# EAGLE design LightSwitch2 (EAGLE 9.0.0)
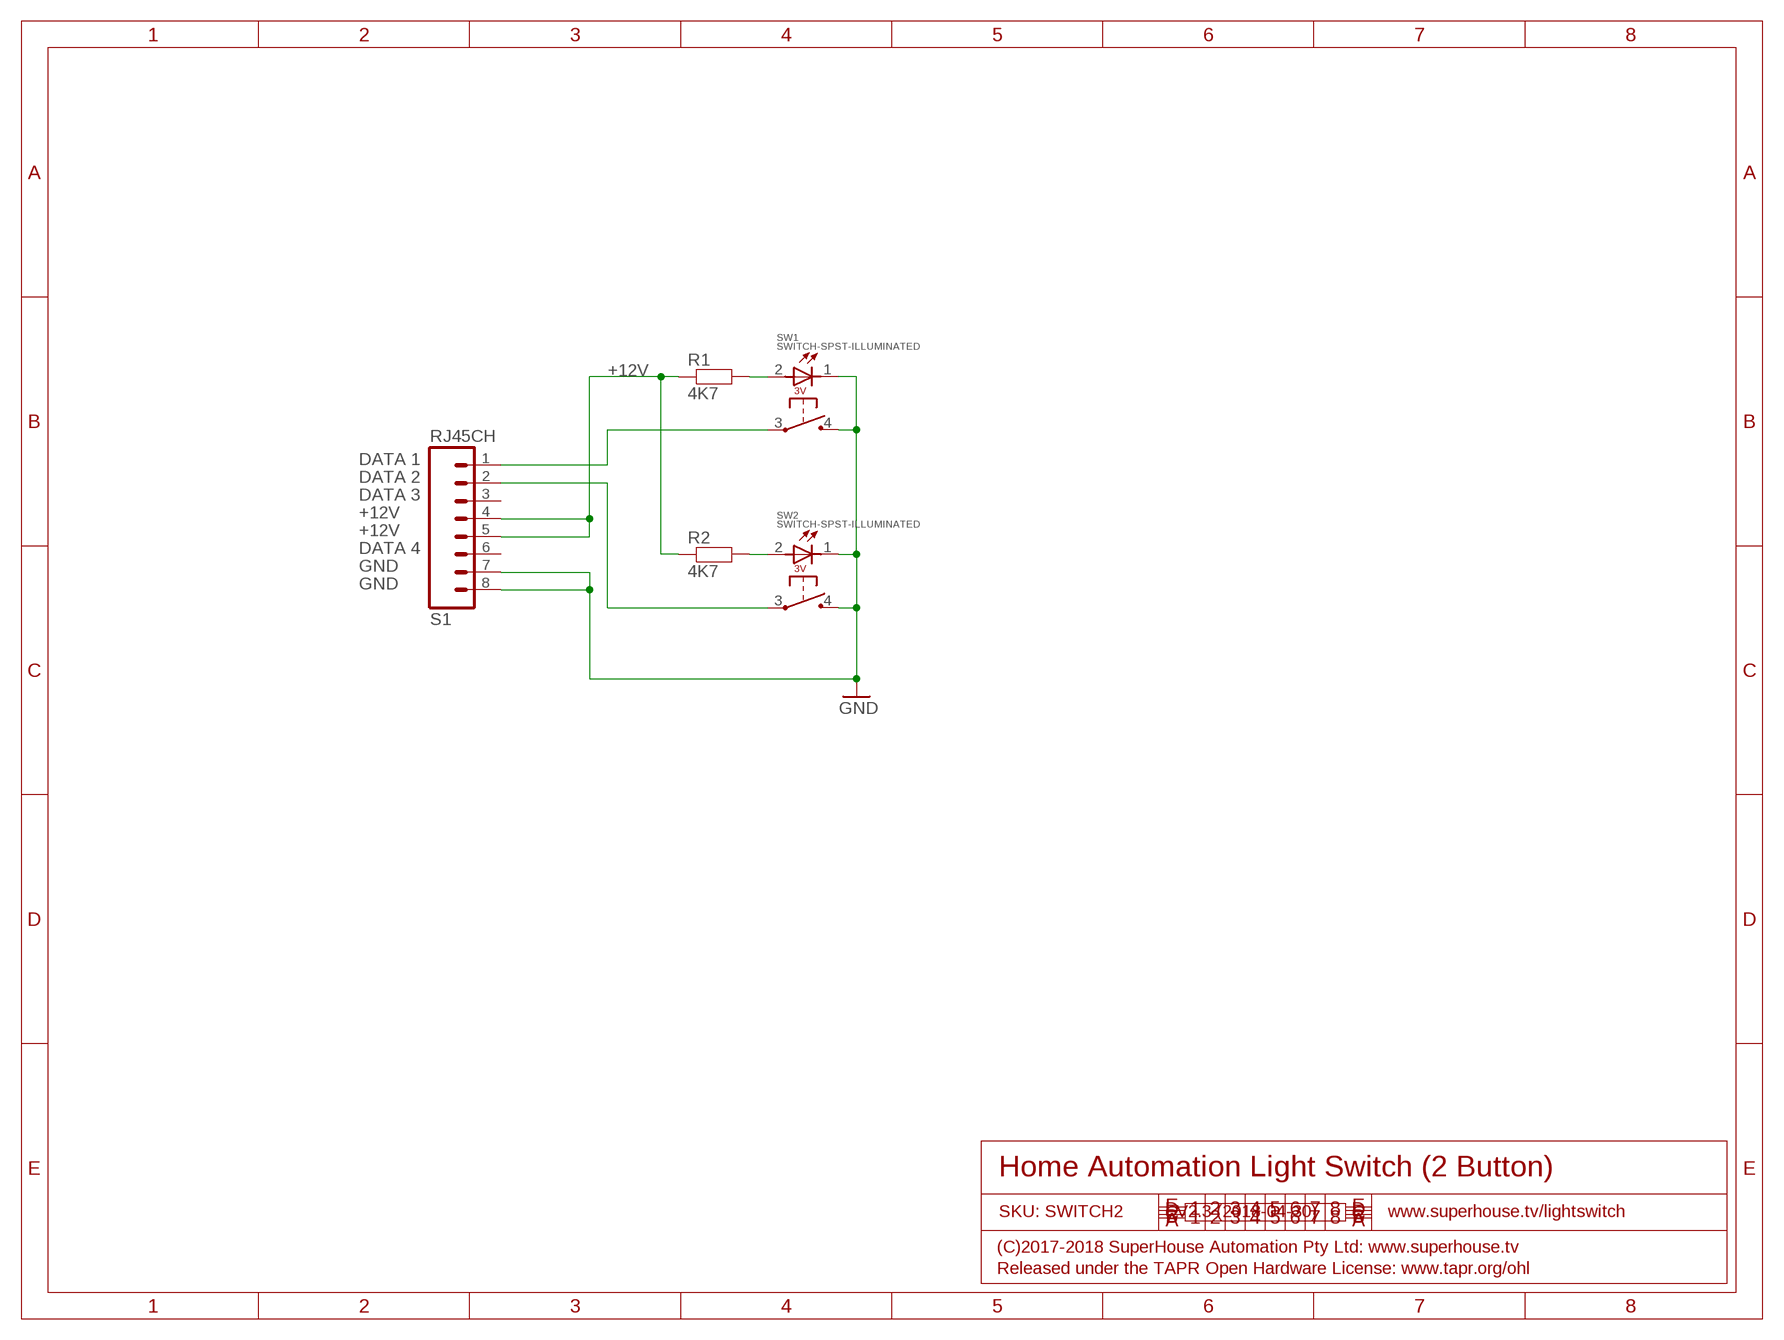
[diagram p0: schematic, sheet 1]

## Parts
R1  4K7  RESISTOR0603  [0603]
R2  4K7  RESISTOR0603  [0603]
S1  RJ45CH  [RJ45CH]
SW1  SWITCH-SPST-ILLUMINATED  [SWITCH-SPST-ILLUMINATED]
SW2  SWITCH-SPST-ILLUMINATED  [SWITCH-SPST-ILLUMINATED]

## Nets
+12V: R1.1 R2.1 S1.4 S1.5
GND: S1.7 S1.8 SW1.1(-) SW1.4(NO) SW2.1(-) SW2.4(NO)
N$1: R1.2 SW1.2(+)
N$2: R2.2 SW2.2(+)
N$4: S1.1 SW1.3(COM)
N$5: S1.2 SW2.3(COM)
Unconnected: S1.3 S1.6

## Notes on the sheet
- DATA 1
- DATA 2
- DATA 3
- +12V
- +12V
- DATA 4
- GND
- GND
- Home Automation Light Switch (2 Button)
- SKU: SWITCH2 | V2.3 (2018-04-30) | www.superhouse.tv/lightswitch
- (C)2017-2018 SuperHouse Automation Pty Ltd: www.superhouse.tv
- Released under the TAPR Open Hardware License: www.tapr.org/ohl

## Library data of the parts
R1 R2 = freetronics-jon:RESISTOR: Resistor Basic schematic elements and footprints for 0603, 1206, and PTH 1/10th watt (small) resistors.
S1 = freetronics-jon:RJ45
SW1 SW2 = freetronics-jon:SWITCH-SPST-ILLUMINATED

## Net classes
0 Default: width 0.203 mm
1 VCC: width 0.305 mm

## Board
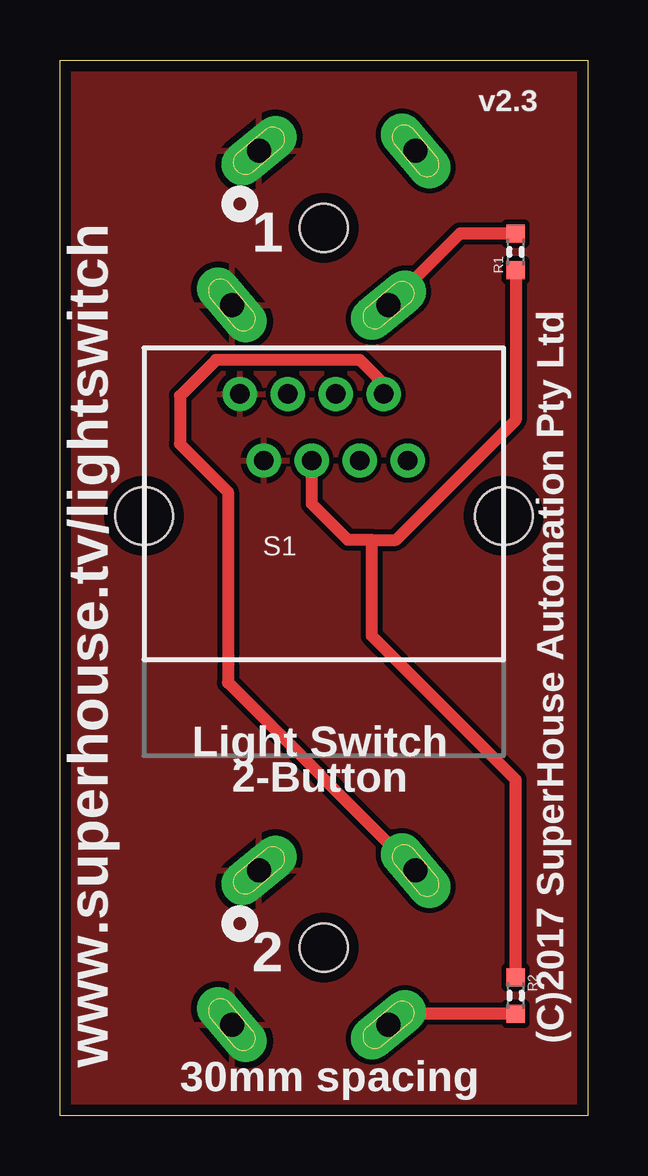
[diagram p1: board, top side]
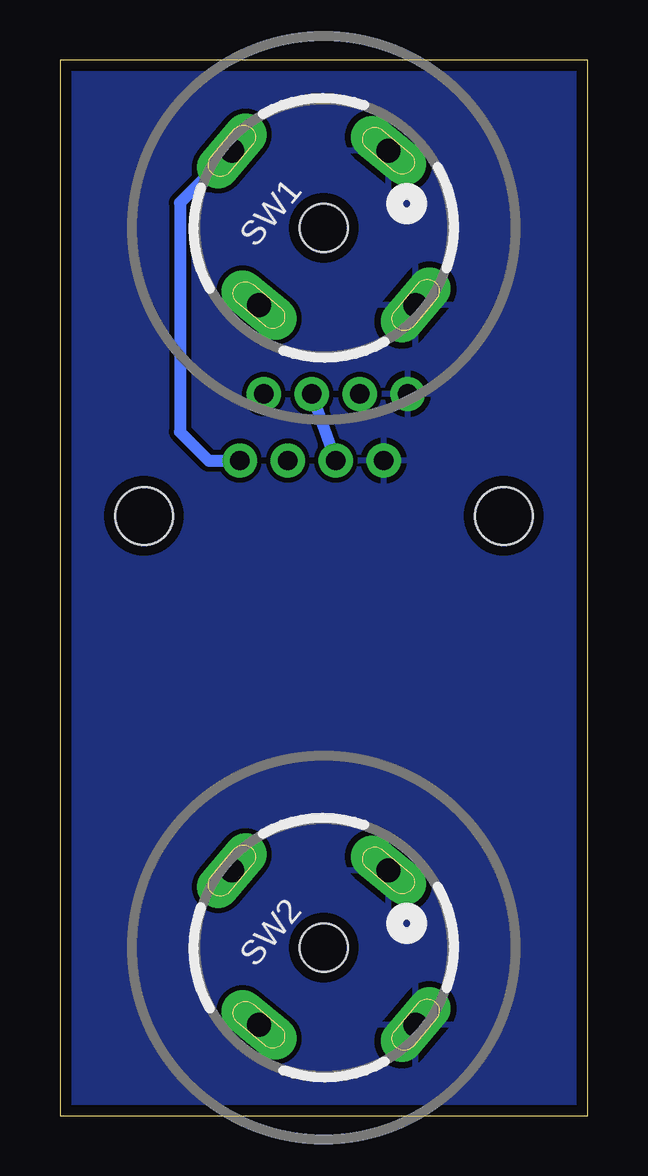
[diagram p2: board, bottom side, seen from below]

Size 22 x 44 mm. Coordinates in mm from the lower left corner, seen from the top.
Outline: 22,0 0,0 0,44 22,44 22,0
Copper layers (1*16): Top 0.035mm / dielectric 1.5mm / Bottom 0.035mm
Design rules "default *": minimum track width 8mil, minimum drill 15mil, track to track 8mil, track to pad 8mil, pad to pad 8mil, via to via 8mil, smd to smd 8mil, copper to edge 18mil, drill to drill 8mil, minimum pad ring 8mil, minimum via ring 6mil, stop-mask expansion 4mil, vias tented up to drill 25mil, thermal gap 10mil
Holes 2 mm at 11,37 11,7

### Footprints (pad centres in the part's own frame; a part is rotated, then mirrored left to right if it is on the bottom)
0603 = smd 0.762 x 0.762: 1 -0.762,0; 2 0.762,0
RJ45CH = drill 0.8 pad 1.422: 1 3.5,2.3; 2 2.5,5.08; 3 1.5,2.3; 4 0.5,5.08; 5 -0.5,2.3; 6 -1.5,5.08; 7 -2.5,2.3; 8 -3.5,5.08 | hole 2.4: -7.5,0; 7.5,0
SWITCH-SPST-ILLUMINATED = drill 1 pad 1.778 long: 1 4.2,0; 2 -4.2,0; 3 0,5; 4 0,-5

### Placement (x,y rotation side)
R1  19,36 90 top
R2  19,5 270 top
S1  11,25 0 top
SW1  11,37 50 bottom
SW2  11,7 50 bottom

### Tracks (layer width: path | path; a pad name or v marks a point on that pad's centre or on a via)
+12V
  Top 0.508: R2.1 19,14 13,20 13,24 | R1.1 19,29 14,24 13,24 | 13,24 12,24 10.5,25.5 S1.5
  Bottom 0.508: S1.5 S1.4
GND
  pour Top: 22,44 0.04,44 0.04,0 22,0
  pour Bottom: 22,44 0.04,44 0.04,0 22,0
N$1
  Top 0.508: R1.2 17,36.76 16.68,36.76 SW1.2
N$2
  Top 0.508: R2.2 14.15,4.24 SW2.2
N$4
  Bottom 0.508: SW1.3 17,38.04 17,28.5 15.8,27.3 S1.1
N$5
  Top 0.508: S1.2 13.5,30.5 12.5,31.5 6.5,31.5 5,30 5,28 7,26 7,18.04 SW2.3

### Text on the board
tPlace: v2.3 | 1 | Light Switch / 2-Button | 2 | (C)2017 SuperHouse Automation Pty Ltd | www.superhouse.tv/lightswitch | 30mm spacing